# Altium project FSM interface board.PrjPcb
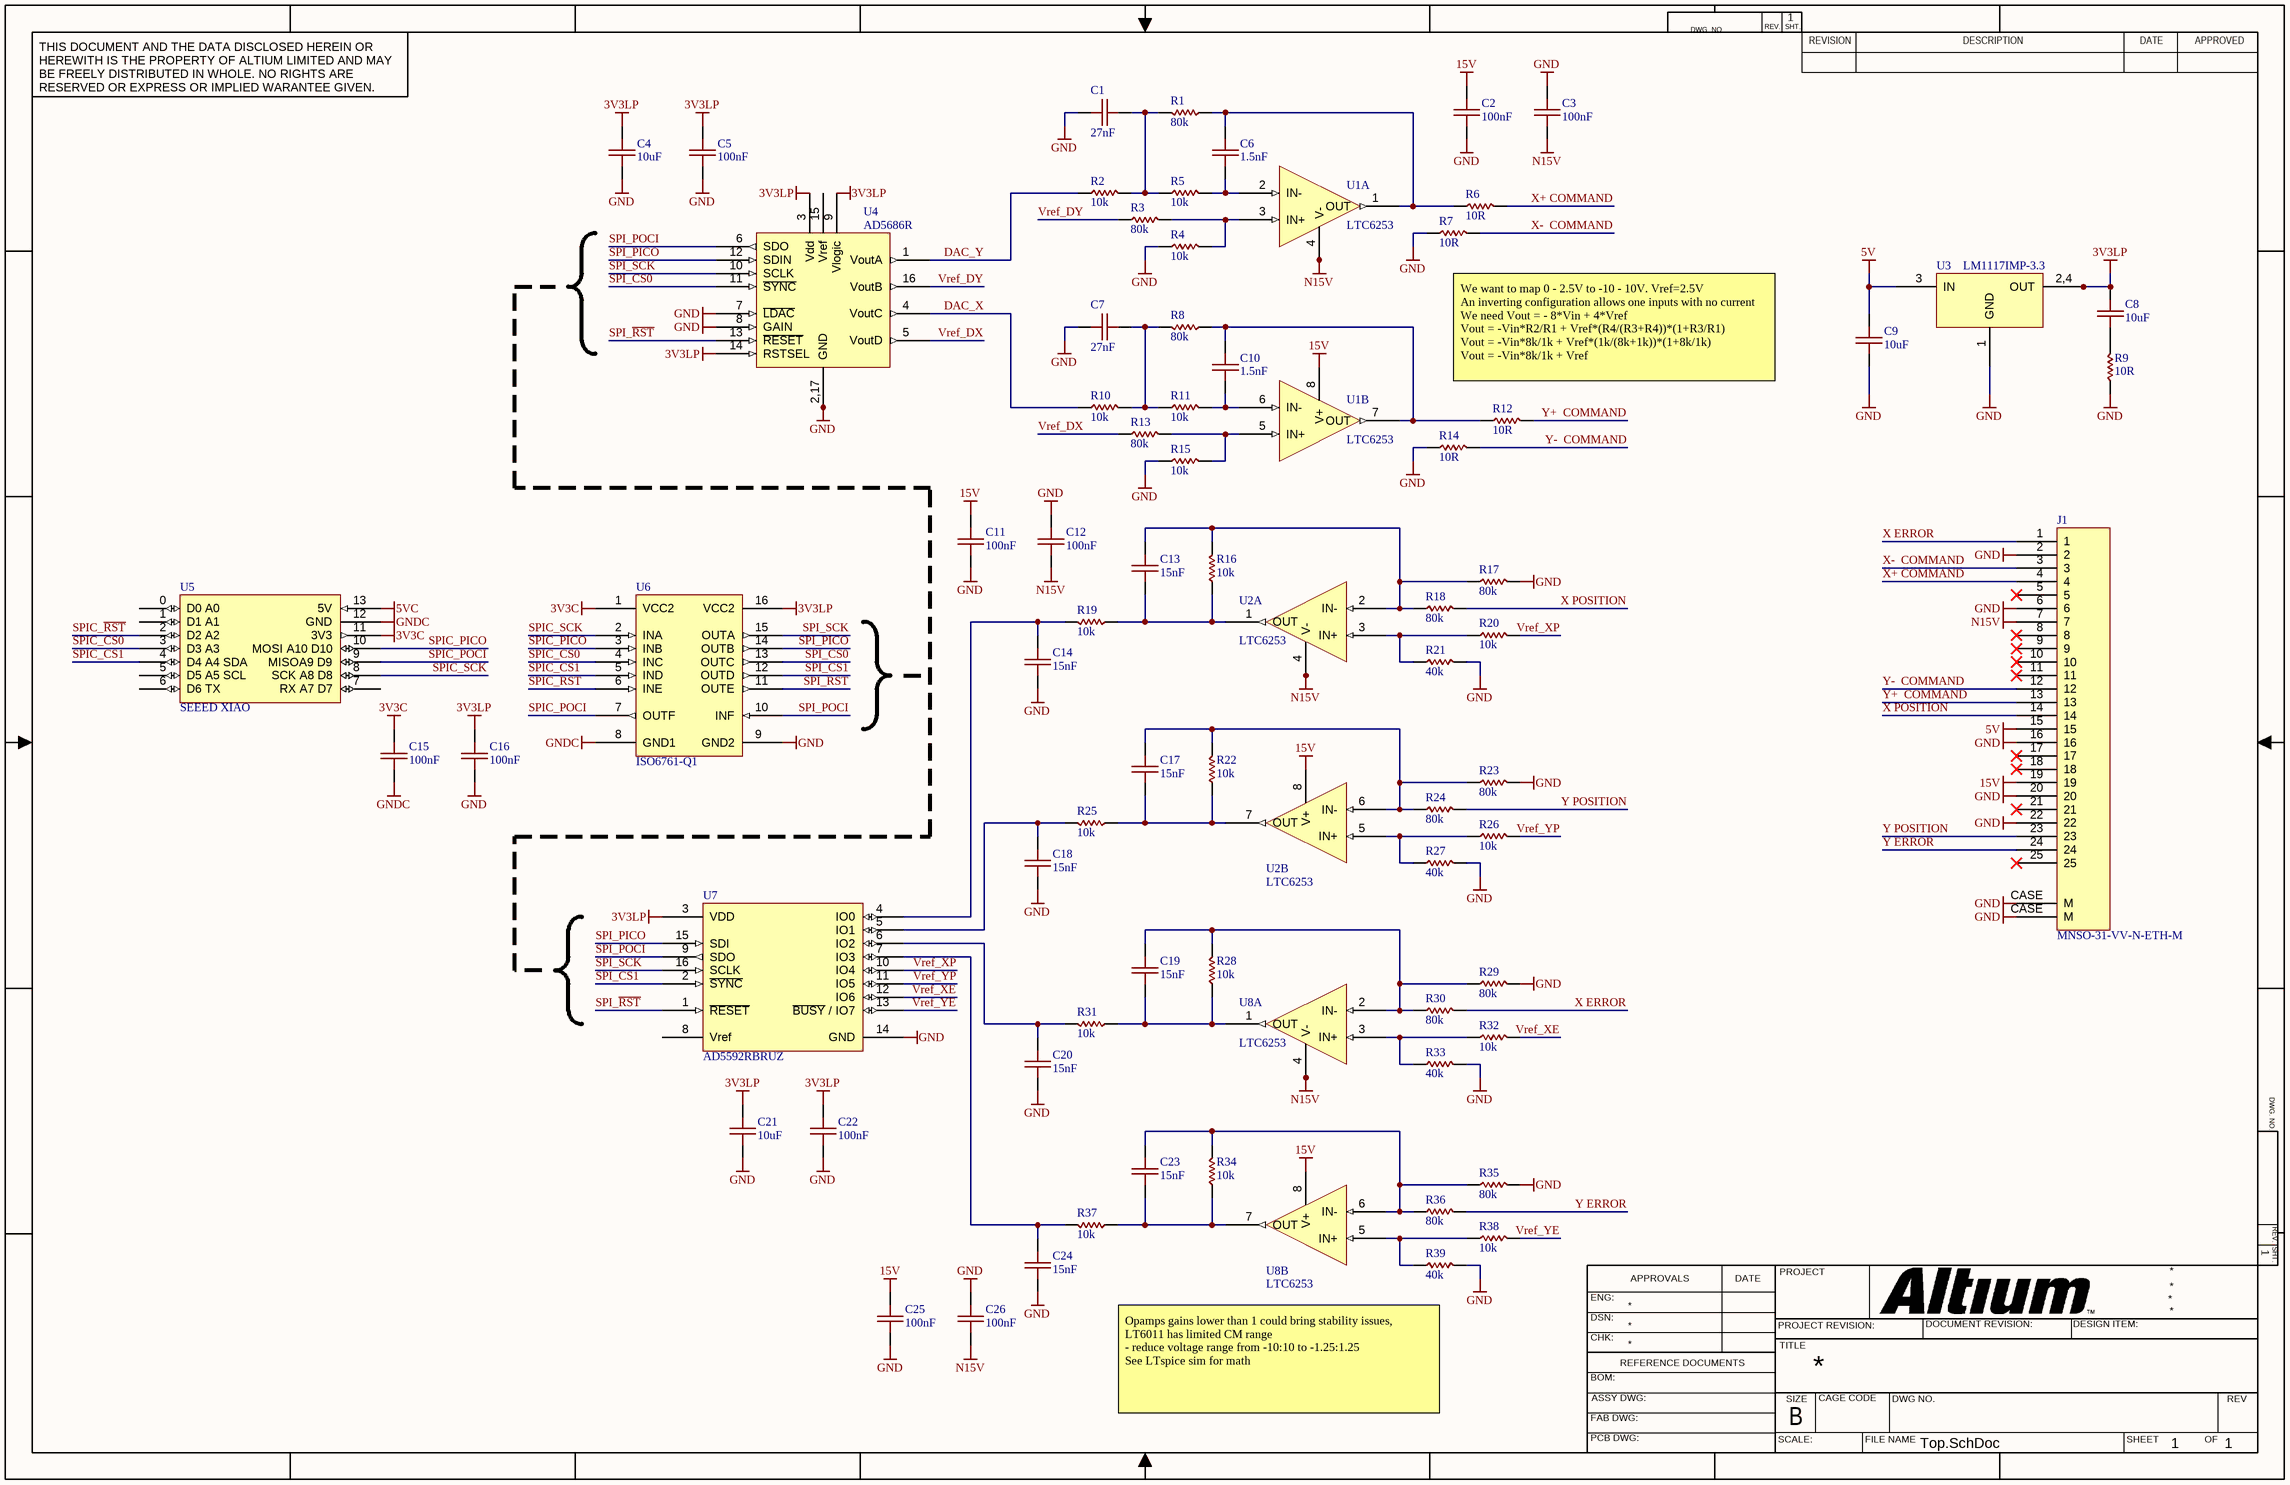
[diagram p0: Top.SchDoc]
1 sheet, 74 parts. Net scope: global (net labels, ports and power ports of the same name join across sheets).
Board file: PCB.PcbDoc

## Sheet Top.SchDoc
size 431 x 279 mm; SheetNumber: 1; SheetTotal: 1

### Parts
C1  27nF  [0603 B]
C2  100nF  [0603 B]
C3  100nF  [0603 B]
C4  10uF  [0603 B]
C5  100nF  [0603 B]
C6  1.5nF  [0603 B]
C7  27nF  [0603 B]
C8  10uF  [0603 B]
C9  10uF  [0603 B]
C10  1.5nF  [0603 B]
C11  100nF  [0603 B]
C12  100nF  [0603 B]
C13  15nF  [0603 B]
C14  15nF  [0603 B]
C15  100nF  [0603 B]
C16  100nF  [0603 B]
C17  15nF  [0603 B]
C18  15nF  [0603 B]
C19  15nF  [0603 B]
C20  15nF  [0603 B]
C21  10uF  [0603 B]
C22  100nF  [0603 B]
C23  15nF  [0603 B]
C24  15nF  [0603 B]
C25  100nF  [0603 B]
C26  100nF  [0603 B]
J1  MNSO-31-VV-N-ETH-M  [DB25-PL]
R1  80k  [0603]
R2  10k  [0603]
R3  80k  [0603]
R4  10k  [0603]
R5  10k  [0603]
R6  10R  [0603]
R7  10R  [0603]
R8  80k  [0603]
R9  10R  [0603]
R10  10k  [0603]
R11  10k  [0603]
R12  10R  [0603]
R13  80k  [0603]
R14  10R  [0603]
R15  10k  [0603]
R16  10k  [0603]
R17  80k  [0603]
R18  80k  [0603]
R19  10k  [0603]
R20  10k  [0603]
R21  40k  [0603]
R22  10k  [0603]
R23  80k  [0603]
R24  80k  [0603]
R25  10k  [0603]
R26  10k  [0603]
R27  40k  [0603]
R28  10k  [0603]
R29  80k  [0603]
R30  80k  [0603]
R31  10k  [0603]
R32  10k  [0603]
R33  40k  [0603]
R34  10k  [0603]
R35  80k  [0603]
R36  80k  [0603]
R37  10k  [0603]
R38  10k  [0603]
R39  40k  [0603]
U1  LTC6253  [MS8]  (parts A,B of 2)
U2  LTC6253  [MS8]  (parts A,B of 2)
U3  LM1117IMP-3.3  [SOT-223]
U4  AD5686R  [TSSOP16]
U5  SEEED XIAO  [Seeed XIAO]
U6  ISO6761-Q1  [SO-16]
U7  AD5592RBRUZ  [TSSOP16]
U8  LTC6253  [MS8]  (parts A,B of 2)

### Nets
3V3C: C15.2 U5.11(3V3) U6.1(VCC2)
3V3LP: C4.2 C5.2 C8.2 C16.2 C21.2 C22.2 U3.2,4(OUT) U3.4(OUT) U4.3(Vdd) U4.9(Vlogic) U4.14(RSTSEL) U6.16(VCC2) U7.3(VDD)
5V: C9.2 J1.15 U3.3(IN)
5VC: U5.13(5V)
15V: C2.2 C11.2 C25.2 J1.19 U1.8(V+) U2.8(V+) U8.8(V+)
GND: C1.2 C2.1 C3.2 C4.1 C5.1 C7.2 C9.1 C11.1 C12.2 C14.1 C16.1 C18.1 C20.1 C21.1 C22.1 C24.1 C25.1 C26.2 J1.2 J1.6 J1.16 J1.20 J1.22 J1.CASE(M) R4.2 R7.2 R9.2 R14.2 R15.2 R17.1 R21.1 R23.1 R27.1 R29.1 R33.1 R35.1 R39.1 U3.1(GND) U4.2,17(GND) U4.7(~{LDAC}) U4.8(GAIN) U4.17(GND) U6.9(GND2) U7.14(GND)
GNDC: C15.1 U5.12(GND) U6.8(GND1)
N15V: C3.1 C12.1 C26.1 J1.7 U1.4(V-) U1.9(V-) U2.4(V-) U2.9(V-) U8.4(V-) U8.9(V-)
DAC_X: R10.2 U4.4(VoutC)
DAC_Y: R2.2 U4.1(VoutA)
SPI_CS0: U4.11(~{SYNC}) U6.13(OUTC)
SPI_CS1: U6.12(OUTD) U7.2(~{SYNC})
SPI_PICO: U4.12(SDIN) U6.14(OUTB) U7.15(SDI)
SPI_POCI: U4.6(SDO) U6.10(INF) U7.9(SDO)
SPI_~{RST}: U4.13(~{RESET}) U6.11(OUTE) U7.1(~{RESET})
SPI_SCK: U4.10(SCLK) U6.15(OUTA) U7.16(SCLK)
SPIC_CS0: U5.3(D3_A3) U6.4(INC)
SPIC_CS1: U5.4(D4_A4_SDA) U6.5(IND)
SPIC_PICO: U5.10(MOSI_A10_D10) U6.3(INB)
SPIC_POCI: U5.9(MISOA9_D9) U6.7(OUTF)
SPIC_~{RST}: U5.2(D2_A2) U6.6(INE)
SPIC_SCK: U5.8(SCK_A8_D8) U6.2(INA)
Vref_DX: R13.2 U4.5(VoutD)
Vref_DY: R3.2 U4.16(VoutB)
Vref_XE: R32.1 U7.12(IO6)
Vref_XP: R20.1 U7.10(IO4)
Vref_YE: R38.1 U7.13(~{BUSY}_/_IO7)
Vref_YP: R26.1 U7.11(IO5)
X ERROR: J1.1 R30.1
X POSITION: J1.14 R18.1
X+ COMMAND: J1.4 R6.1
X-  COMMAND: J1.3 R7.1
Y ERROR: J1.24 R36.1
Y POSITION: J1.23 R24.1
Y+  COMMAND: J1.13 R12.1
Y-  COMMAND: J1.12 R14.1
NetC1_1: C1.1 R1.1 R2.1 R5.2
NetC6_1: C6.1 R5.1 U1.2(IN-)
NetC6_2: C6.2 R1.2 R6.2 U1.1(OUT)
NetC7_1: C7.1 R8.1 R10.1 R11.2
NetC8_1: C8.1 R9.1
NetC10_1: C10.1 R11.1 U1.6(IN-)
NetC10_2: C10.2 R8.2 R12.2 U1.7(OUT)
NetC13_1: C13.1 R16.2 R19.2 U2.1(OUT)
NetC13_2: C13.2 R16.1 R17.2 R18.2 U2.2(IN-)
NetC14_2: C14.2 R19.1 U7.4(IO0)
NetC17_1: C17.1 R22.2 R25.2 U2.7(OUT)
NetC17_2: C17.2 R22.1 R23.2 R24.2 U2.6(IN-)
NetC18_2: C18.2 R25.1 U7.5(IO1)
NetC19_1: C19.1 R28.2 R31.2 U8.1(OUT)
NetC19_2: C19.2 R28.1 R29.2 R30.2 U8.2(IN-)
NetC20_2: C20.2 R31.1 U7.6(IO2)
NetC23_1: C23.1 R34.2 R37.2 U8.7(OUT)
NetC23_2: C23.2 R34.1 R35.2 R36.2 U8.6(IN-)
NetC24_2: C24.2 R37.1 U7.7(IO3)
NetR3_1: R3.1 R4.1 U1.3(IN+)
NetR13_1: R13.1 R15.1 U1.5(IN+)
NetR20_2: R20.2 R21.2 U2.3(IN+)
NetR26_2: R26.2 R27.2 U2.5(IN+)
NetR32_2: R32.2 R33.2 U8.3(IN+)
NetR38_2: R38.2 R39.2 U8.5(IN+)

Not connected (* = marked no-connect by the designer): J1 5* 8* 9* 10* 11* 17* 18* 21* 25*; U4 15(Vref); U5 0(D0_A0) 1(D1_A1) 5(D5_A5_SCL) 6(D6_TX) 7(RX_A7_D7); U7 8(Vref)

### Notes on the sheet
- We want to map 0 - 2.5V to -10 - 10V. Vref=2.5V
  An inverting configuration allows one inputs with no current
  We need Vout = - 8*Vin + 4*Vref
  Vout = -Vin*R2/R1 + Vref*(R4/(R3+R4))*(1+R3/R1)
  Vout = -Vin*8k/1k + Vref*(1k/(8k+1k))*(1+8k/1k)
  Vout = -Vin*8k/1k + Vref
- (near R39) Opamps gains lower than 1 could bring stability issues,
  LT6011 has limited CM range
  - reduce voltage range from -10:10 to -1.25:1.25
  See LTspice sim for math
- DWG. NO.
- REV.
- SHT.
- THIS DOCUMENT AND THE DATA DISCLOSED HEREIN OR HEREWITH IS THE PROPERTY OF ALTIUM LIMITED AND MAY BE FREELY DISTRIBUTED IN WHOLE. NO RIGHTS ARE RESERVED OR EXPRESS OR IMPLIED WARANTEE GIVEN.
- REVISION
- DESCRIPTION
- DATE
- APPROVED
- ENG:
- APPROVALS
- PROJECT
- DSN:
- CHK:
- REFERENCE DOCUMENTS
- PROJECT REVISION:
- TITLE
- DOCUMENT REVISION:
- DESIGN ITEM:
- BOM:
- FAB DWG:
- PCB DWG:
- ASSY DWG:
- SCALE:
- SIZE
- B
- CAGE CODE
- FILE NAME
- DWG NO.
- SHEET
- OF
- REV

### Library data of the parts
C1-C26 = CAP 0603: 603 Capacitor
  C1 C7: Value: 27nF
  C2 C3 C5 C11 C12 C15 C16 C22 C25 C26: Value: 100nF
  C4 C8 C9 C21: Value: 10uF
  C6 C10: Value: 1.5nF
  C13 C14 C17-C20 C23 C24: Value: 15nF
J1 = DSUB25-PL: 31 Contacts Surface Mount Vertical Female Nano-D; COTS ref: A29200-031; Ref: MNSO-31-VV-N-ETH-M
R1-R39 = RES 0603: 603 Resistor
  R1 R3 R8 R13 R17 R18 R23 R24 R29 R30 R35 R36: Value: 80k
  R2 R4 R5 R10 R11 R15 R16 R19 R20 R22 R25 R26 R28 R31 R32 R34 R37 R38: Value: 10k
  R6 R7 R9 R12 R14: Value: 10R
  R21 R27 R33 R39: Value: 40k
U1 U2 U8 = LT6011: Dual 35μA, 14nV/√Hz, Rail-to-Rail Output Precision Op Amp; Ref: LTC6253
U3 = LM1117-3.3: 800-mA Low-Dropout Linear Regulator; Ref: LM1117IMP-3.3
U4 = AD5686R: Quad, 16-Bit DAC with 2 ppm/°C Reference, SPI Interface; pin to pad: 1>3 2,17>4 3>5 4>6 5>7 6>8 7>9 8>10 9>11 10>12 11>13 12>14 13>15 14>16 15>1 16>2 17>none; Ref: AD5686R
U5 = XIAO nRF52840: nRF52840; Ref: SEEED XIAO
U6 = ISO6761-Q1: General-Purpose Six-Channel Automotive Reinforced Digital Isolators with Robust EMC; Ref: ISO6761-Q1
U7 = AD5592RBRUZ: 8-Channel, 12-Bit, Configurable ADC/DAC with On-Chip Reference, SPI Interface, TSSOP; Ref: AD5592RBRUZ